# EAGLE design UV led module (EAGLE 9.1.3)
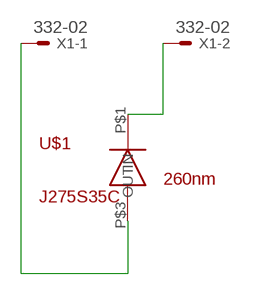
[diagram p0: schematic, sheet 1]

## Parts
U$1  J275S35C  [J275S35C]
X1  332-02  [332-02]

## Nets
N$1: U$1.P$1(OUT) X1.2
N$2: U$1.P$3(IN) X1.1

## Library data of the parts
U$1 = custom parts:J275S35C
X1 = con-garry:332-02: 2 Pin - 2mm Dual Row Source: www.mpe-connector.de / garry_shortform_2012.pdf

## Board
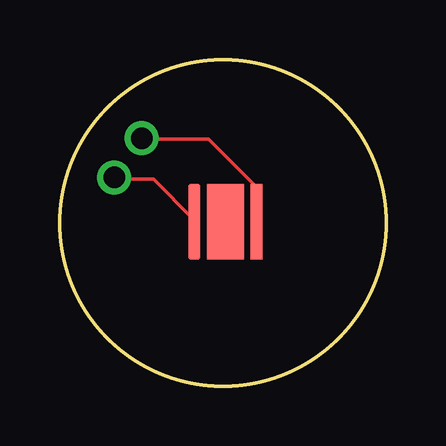
[diagram p1: board, top side]
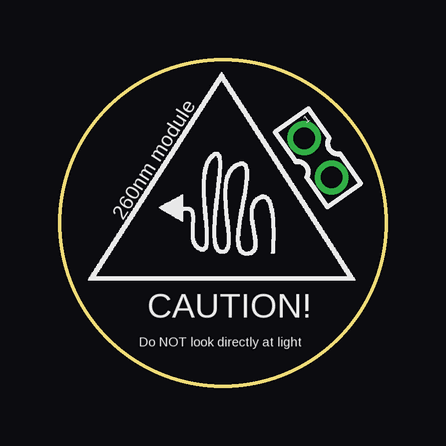
[diagram p2: board, bottom side, seen from below]

Size 13.6 x 13.6 mm. Coordinates in mm from the lower left corner, seen from the top.
Outline: circle at 6.8,6.8 radius 6.8
Copper layers (1*16): Top 0.035mm / dielectric 1.5mm / Bottom 0.035mm
Design rules "default": minimum track width 6mil, minimum drill 0.35mm, track to track 6mil, track to pad 6mil, pad to pad 6mil, via to via 6mil, smd to smd 6mil, copper to edge 40mil, drill to drill 6mil, minimum pad ring 10mil, minimum via ring 8mil, stop-mask expansion 4mil, vias tented up to drill 0mil, thermal gap 10mil

### Footprints (pad centres in the part's own frame; a part is rotated, then mirrored left to right if it is on the bottom)
J275S35C = smd 0.5 x 3.15: P$1 -1.2,0.05; P$3 1.4,0.05 | smd 1.55 x 3.15: P$2 0.1,0.05
332-02 = drill 0.9 pad 1.27: 1 0,-1; 2 0,1

### Placement (x,y rotation side)
U$1  6.8,6.8 0 top
X1  2.84,9.52 215 bottom

### Tracks (layer width: path | path; a pad name or v marks a point on that pad's centre or on a via)
N$1
  Top 0.152: X1.2 2.38,8.63 3.9,8.63 5.58,6.95 U$1.P$1
N$2
  Top 0.152: X1.1 3.45,10.3 6.19,10.3 8.17,8.32 8.17,6.95 U$1.P$3

### Text on the board
bNames: 260nm module | CAUTION! | Do NOT look directly at light